# Altium schematic sheet LoRa.SchDoc
size A4
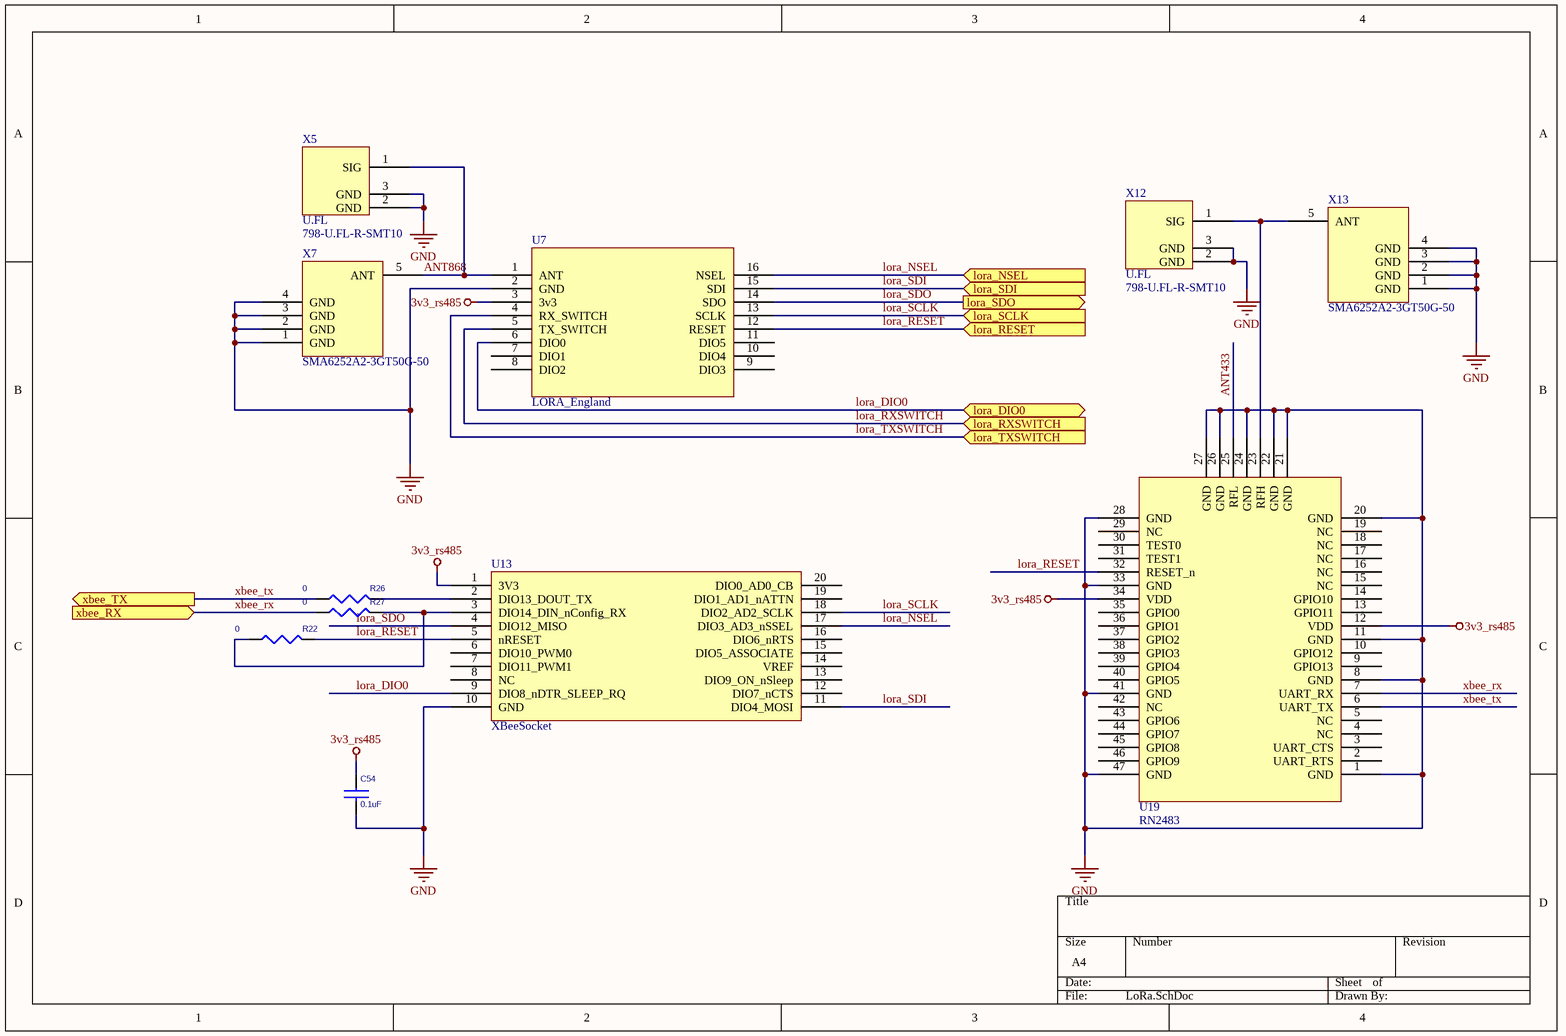
[diagram p0: LoRa.SchDoc]

## Parts
C54  0.1uF  [CAPC2012X09M]
R22  0  [RESC2013X06M]
R26  0  [RESC2013X06M]
R27  0  [RESC2013X06M]
U7  LORA_England  [DIP16]
U13  XBeeSocket  [DIP20_XBEE]
U19  RN2483  [RN2483]
X5  U.FL  Supplier Part Number 1: 798-U.FL-R-SMT10  [U.FL]
X7  SMA6252A2-3GT50G-50  [SMA6252A2-3GT50G-50]
X12  U.FL  Supplier Part Number 1: 798-U.FL-R-SMT10  [U.FL]
X13  SMA6252A2-3GT50G-50  [SMA6252A2-3GT50G-50]

## Ports
lora_DIO0 (bidir), lora_NSEL (in), lora_RESET (in), lora_RXSWITCH (in), lora_SCLK (in), lora_SDI (in), lora_SDO (out), lora_TXSWITCH (in), xbee_RX (in), xbee_TX (out)

## Nets
3v3_rs485: C54.1 U7.3(3v3) U13.1(3V3) U19.12(VDD) U19.34(VDD)
GND: C54.2 U7.2(GND) U13.10(GND) U19.1(GND) U19.8(GND) U19.11(GND) U19.20(GND) U19.21(GND) U19.22(GND) U19.24(GND) U19.26(GND) U19.27(GND) U19.28(GND) U19.33(GND) U19.41(GND) U19.47(GND) X5.2(GND) X5.3(GND) X7.1(GND) X7.2(GND) X7.3(GND) X7.4(GND) X12.2(GND) X12.3(GND) X13.1(GND) X13.2(GND) X13.3(GND) X13.4(GND)
ANT433: U19.25(RFL)
ANT868: U7.1(ANT) X5.1(SIG) X7.5(ANT)
lora_DIO0: U7.6(DIO0) U13.9(DIO8_nDTR_SLEEP_RQ) ; port lora_DIO0
lora_NSEL: U7.16(NSEL) U13.17(DIO3_AD3_nSSEL) ; port lora_NSEL
lora_RESET: R22.2 U7.12(RESET) U13.5(nRESET) U19.32(RESET_n) ; port lora_RESET
lora_RXSWITCH: U7.5(TX_SWITCH) ; port lora_RXSWITCH
lora_SCLK: U7.13(SCLK) U13.18(DIO2_AD2_SCLK) ; port lora_SCLK
lora_SDI: U7.15(SDI) U13.11(DIO4_MOSI) ; port lora_SDI
lora_SDO: U7.14(SDO) U13.4(DIO12_MISO) ; port lora_SDO
lora_TXSWITCH: U7.4(RX_SWITCH) ; port lora_TXSWITCH
xbee_rx: R27.1 U19.7(UART_RX) ; port xbee_RX
xbee_tx: R26.1 U19.6(UART_TX) ; port xbee_TX
NetR22_1: R22.1 R27.2 U13.3(DIO14_DIN_nConfig_RX)
NetR26_2: R26.2 U13.2(DIO13_DOUT_TX)
NetU19_23: U19.23(RFH) X12.1(SIG) X13.5(ANT)

Not connected (* = marked no-connect by the designer): U7 7(DIO1) 8(DIO2) 9(DIO3) 10(DIO4) 11(DIO5); U13 6(DIO10_PWM0) 7(DIO11_PWM1) 8(NC) 12(DIO7_nCTS) 13(DIO9_ON_nSleep) 14(VREF) 15(DIO5_ASSOCIATE) 16(DIO6_nRTS) 19(DIO1_AD1_nATTN) 20(DIO0_AD0_CB); U19 2(UART_RTS) 3(UART_CTS) 4(NC) 5(NC) 9(GPIO13) 10(GPIO12) 13(GPIO11) 14(GPIO10) 15(NC) 16(NC) 17(NC) 18(NC) 19(NC) 29(NC) 30(TEST0) 31(TEST1) 35(GPIO0) 36(GPIO1) 37(GPIO2) 38(GPIO3) 39(GPIO4) 40(GPIO5) 42(NC) 43(GPIO6) 44(GPIO7) 45(GPIO8) 46(GPIO9)

## Library data of the parts
C54 = CAP_SMD_0.1UF_10%: CAP CER 0.1UF 25V 10% X7R 0805; Value: 0.1uF; Supplier 1: Digi-Key; Supplier Part Number 1: 399-1168-6-ND
R22 R26 R27 = RES_SMD_0: RES 0.0 OHM 1/8W JUMP 0805 SMD; Supplier 1: Digi-Key; Supplier Part Number 1: P0.0ATR-ND
U7 = LORA_MODULE_E
U13 = XBEE_Module
U19 = RN2383
X7 X13 = SMA_CONN: Supplier 1: Mouser; Supplier Part Number 1: 523-901-143-6RFX
X5 X12 = U.FL: Supplier 1: Mouser